# Altium schematic sheet 4-JTAG.SchDoc: JTAG
size A4; Author: Alexandre Cosneau; CompanyName: Tristar Multicopters; DrawnBy: Alexandre Cosneau; Engineer: Alexandre Cosneau; Organization: Tristar Multicopters; Address1: Genie / GEGI; Address2: 2500 boulevard de l'universite; Address3: J1K2R SHERBROOKE; Address4: QUEBEC, CANADA; DocumentNumber: 13; Revision: 1.0; SheetNumber: 13; SheetTotal: 15
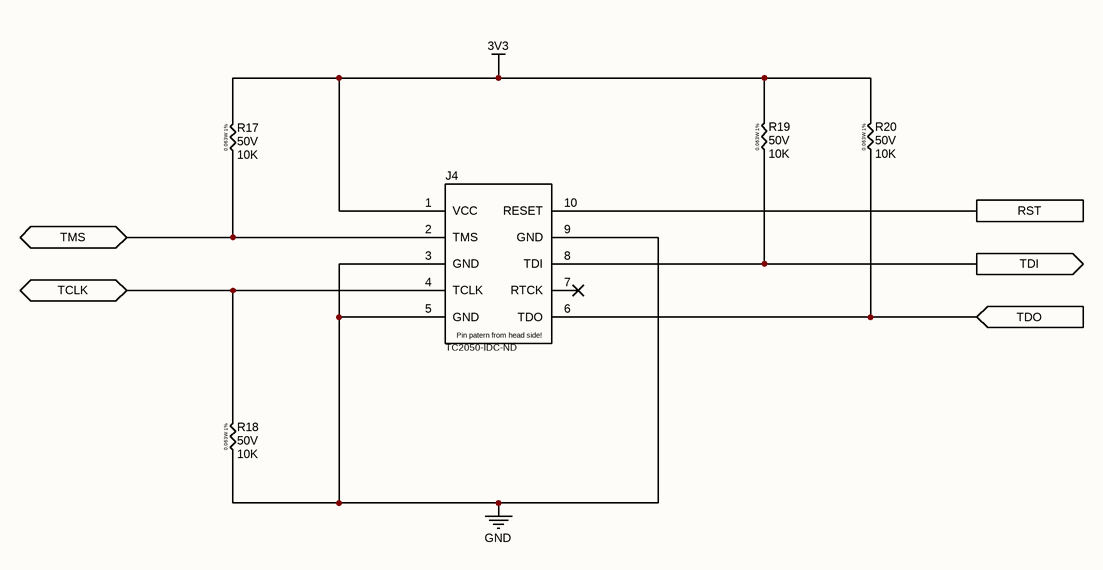
[diagram p0: 4-JTAG.SchDoc]

## Parts
J4  Supplier Part Number 1: TC2050-IDC-ND  [TC2050-IDC-FP]  (hidden comment: TC2050-IDC-FP)  (net tie, no BOM)
R17  VDC: 50V  [R 0402(1005)-1%]  (hidden comment: 10K)
R18  VDC: 50V  [R 0402(1005)-1%]  (hidden comment: 10K)
R19  VDC: 50V  [R 0402(1005)-1%]  (hidden comment: 10K)
R20  VDC: 50V  [R 0402(1005)-1%]  (hidden comment: 10K)

## Ports
RST, TCLK (bidir), TDI (out), TDO (in), TMS (bidir)

## Nets
3V3: J4.1(VCC) R17.2 R19.2 R20.2
GND: J4.3(GND) J4.5(GND) J4.9(GND) R18.1
RST: J4.10(RESET) ; port RST
TCLK: J4.4(TCLK) R18.2 ; port TCLK
TDI: J4.8(TDI) R19.1 ; port TDI
TDO: J4.6(TDO) R20.1 ; port TDO
TMS: J4.2(TMS) R17.1 ; port TMS

Not connected (* = marked no-connect by the designer): J4 7(RTCK)*

## Notes on the sheet
- Title:
- Size:
- Date:
- A
- Revision:
- Time:
- Author:
- Sheet
- of
- File:
- (in symbol RES 0402-1%) 0.063W 1%
- (in symbol TC2050-IDC-FP) Pin patern from head side!

## Library data of the parts
J4 = TC2050-IDC-FP: 10 PIN JTAG PROBE; Supplier 1: Digi-Key
R17-R20 = RES 0402-1%: SMD 0402 0.063W 1% 50V; Manufacturer: YAGEO; TempCo: ±100ppm/°C; Package-mm: 1005; Value Code: 1001; Power: 0.0625W; Part Number: *; Mount Type: SMT; Publisher: Hefest; Manufacturer Alternate: *; Published: 07.04.2019; Supplier 1: Comet; Supplier 2: *; Supplier 3: *; Supplier Part Number 1: R0402 1.0K 1% YAG/ASJ; Supplier Part Number 2: *; Supplier Part Number 3: *; RoHS: Y; Technology: Thick film; Value 2: *; Package: 0402; Tolerance %: ±1%; ComponentLink1Description: Datasheet link; ComponentLink1URL: https://store.comet.bg/download-file.php?id=1224; Temperature Range: -55°C ~ +155°C; Price: 0.015; Part Number Alternate: *; TYPE: Resistor; Value 1: *; Value: 10K